# EAGLE schematic Traffic Light Contoller v10 (EAGLE 5.03)
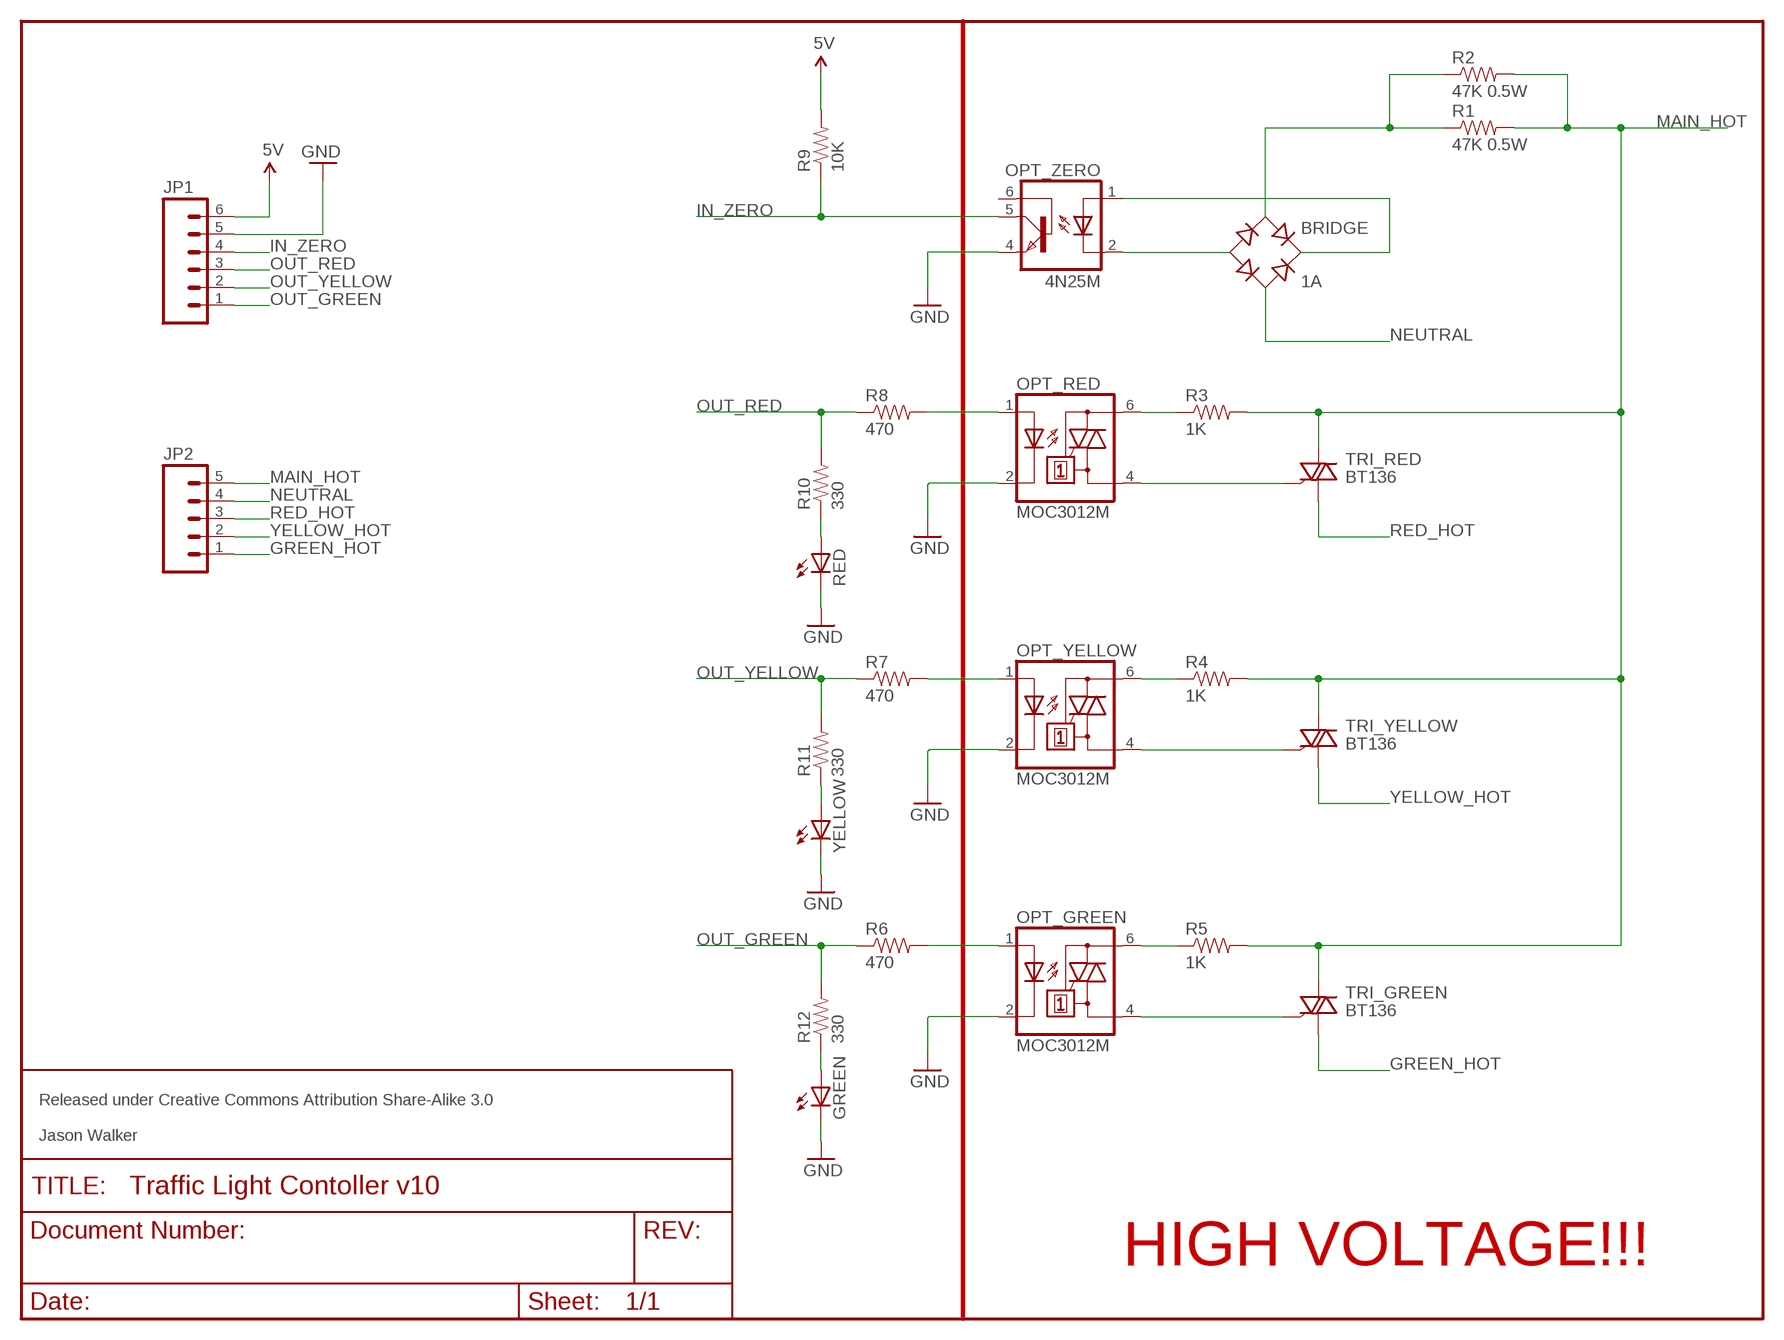
[diagram p0: schematic, sheet 1]

## Parts
BRIDGE  1A  RECTIFIER-1KAB  [1KAB]
GREEN  LED3MM  [LED3MM]
JP1  M06SIP  [1X06]
JP2  M05LOCK  [1X05_LOCK]
OPT_GREEN  MOC3012M  [DIL06]
OPT_RED  MOC3012M  [DIL06]
OPT_YELLOW  MOC3012M  [DIL06]
OPT_ZERO  4N25M  [DIL06]
R1  47K 0.5W  RESISTORPTH1  [AXIAL-0.3]
R2  47K 0.5W  RESISTORPTH1  [AXIAL-0.3]
R3  1K  RESISTORPTH1  [AXIAL-0.3]
R4  1K  RESISTORPTH1  [AXIAL-0.3]
R5  1K  RESISTORPTH1  [AXIAL-0.3]
R6  470  RESISTORPTH1  [AXIAL-0.3]
R7  470  RESISTORPTH1  [AXIAL-0.3]
R8  470  RESISTORPTH1  [AXIAL-0.3]
R9  10K  RESISTORPTH1  [AXIAL-0.3]
R10  330  RESISTORPTH1  [AXIAL-0.3]
R11  330  RESISTORPTH1  [AXIAL-0.3]
R12  330  RESISTORPTH1  [AXIAL-0.3]
RED  LED3MM  [LED3MM]
TRI_GREEN  BT136  [TO220AB]
TRI_RED  BT136  [TO220AB]
TRI_YELLOW  BT136  [TO220AB]
YELLOW  LED3MM  [LED3MM]

## Nets
5V: JP1.6 R9.P$2
GND: GREEN.K(C) JP1.5 OPT_GREEN.2(C) OPT_RED.2(C) OPT_YELLOW.2(C) OPT_ZERO.4(EMI) RED.K(C) YELLOW.K(C)
GREEN_HOT: JP2.1 TRI_GREEN.1(A1)
IN_ZERO: JP1.4 OPT_ZERO.5(COL) R9.P$1
MAIN_HOT: JP2.5 R1.P$2 R2.P$2 R3.P$2 R4.P$2 R5.P$2 TRI_GREEN.2(A2) TRI_RED.2(A2) TRI_YELLOW.2(A2)
N$1: BRIDGE.- OPT_ZERO.2(C)
N$2: BRIDGE.+ OPT_ZERO.1(A)
N$3: BRIDGE.AC1 R1.P$1 R2.P$1
N$4: OPT_YELLOW.1(A) R7.P$2
N$5: OPT_YELLOW.6(A2) R4.P$1
N$6: OPT_RED.6(A2) R3.P$1
N$7: OPT_YELLOW.4(A1) TRI_YELLOW.3(G)
N$8: OPT_GREEN.1(A) R6.P$2
N$10: OPT_GREEN.6(A2) R5.P$1
N$11: R10.P$1 RED.A
N$12: R11.P$1 YELLOW.A
N$13: GREEN.A R12.P$1
N$14: OPT_RED.1(A) R8.P$2
N$21: OPT_GREEN.4(A1) TRI_GREEN.3(G)
N$23: OPT_RED.4(A1) TRI_RED.3(G)
NEUTRAL: BRIDGE.AC2 JP2.4
OUT_GREEN: JP1.1 R6.P$1 R12.P$2
OUT_RED: JP1.3 R8.P$1 R10.P$2
OUT_YELLOW: JP1.2 R7.P$1 R11.P$2
RED_HOT: JP2.3 TRI_RED.1(A1)
YELLOW_HOT: JP2.2 TRI_YELLOW.1(A1)
Unconnected: OPT_ZERO.6(BAS)

## Notes on the sheet
- Released under Creative Commons Attribution Share-Alike 3.0
- Jason Walker
- HIGH VOLTAGE!!!

## Library data of the parts
BRIDGE = rectifier:RECTIFIER-: Rectifier
GREEN RED YELLOW = SparkFun:LED: LEDs Standard schematic elements and footprints for 5mm, 3mm, 1206, and 0603 sized LEDs. 5mm - Spark Fun Electronics SKU : COM-00529 (and others)
JP1 = SparkFun:M06: Header 6 Standard 6-pin 0.1" header. Use with straight break away headers (SKU : PRT-00116), right angle break away headers (PRT-00553), swiss pins (PRT-00743), machine pins (PRT-00117), and female headers (PRT-00115). Molex polarized connector foot print use with SKU : PRT-08094 with associated crimp pins and housings. NOTES ON THE VARIANTS LOCK and LOCK_LONGPADS... This footprint was designed to help hold the alignment of a through-hole component (i.e. 6-pin header) while soldering it into place. You may notice that each hole has been shifted either up or down by 0.005 of an inch from it's more standard position (which is a perfectly straight line). This slight alteration caused the pins (the squares in the middle) to touch the edges of the holes. Because they are alternating, it causes a "brace" to hold the component in place. 0.005 has proven to be the perfect amount of "off-center" position when using our standard breakaway headers. Although looks a little odd when you look at the bare footprint, once you have a header in there, the alteration is very hard to notice. Also, if you push a header all the way into place, it is covered up entirely on the bottom side. This idea of altering the position of holes to aid alignment will be further integrated into the Sparkfun Library for other footprints. It can help hold any component with 3 or more connection pins.
JP2 = SparkFun:M05: Header 5 Standard 5-pin 0.1" header. Use with straight break away headers (SKU : PRT-00116), right angle break away headers (PRT-00553), swiss pins (PRT-00743), machine pins (PRT-00117), and female headers (PRT-00115). Molex polarized connector foot print use with SKU : PRT-08230 with associated crimp pins and housings.
OPT_GREEN OPT_RED OPT_YELLOW = optocoupler:MOC30*M: RANDOM-PHASE OPTOISOLATORS TRIAC DRIVER OUTPUT Source: http://www.fairchildsemi.com MOC3020-M.pdf
OPT_ZERO = optocoupler:4N*?M: General Purpose 6-Pin Phototransistor Optocouplers Source: http://www.fairchildsemi.com/ds/4N/4N35-M.pdf
R1-R12 = SparkFun:RESISTOR: Resistor Basic schematic elements and footprints for 0603, 1206, and PTH 1/10th watt (small) resistors.
TRI_GREEN TRI_RED TRI_YELLOW = triac:BT136: Triac BT136 series E sensitive gate Source: http://www.nxp.com/acrobat_download/datasheets/BT136_SERIES_E_2.pdf